# Altium schematic sheet MCU.SchDoc
size A
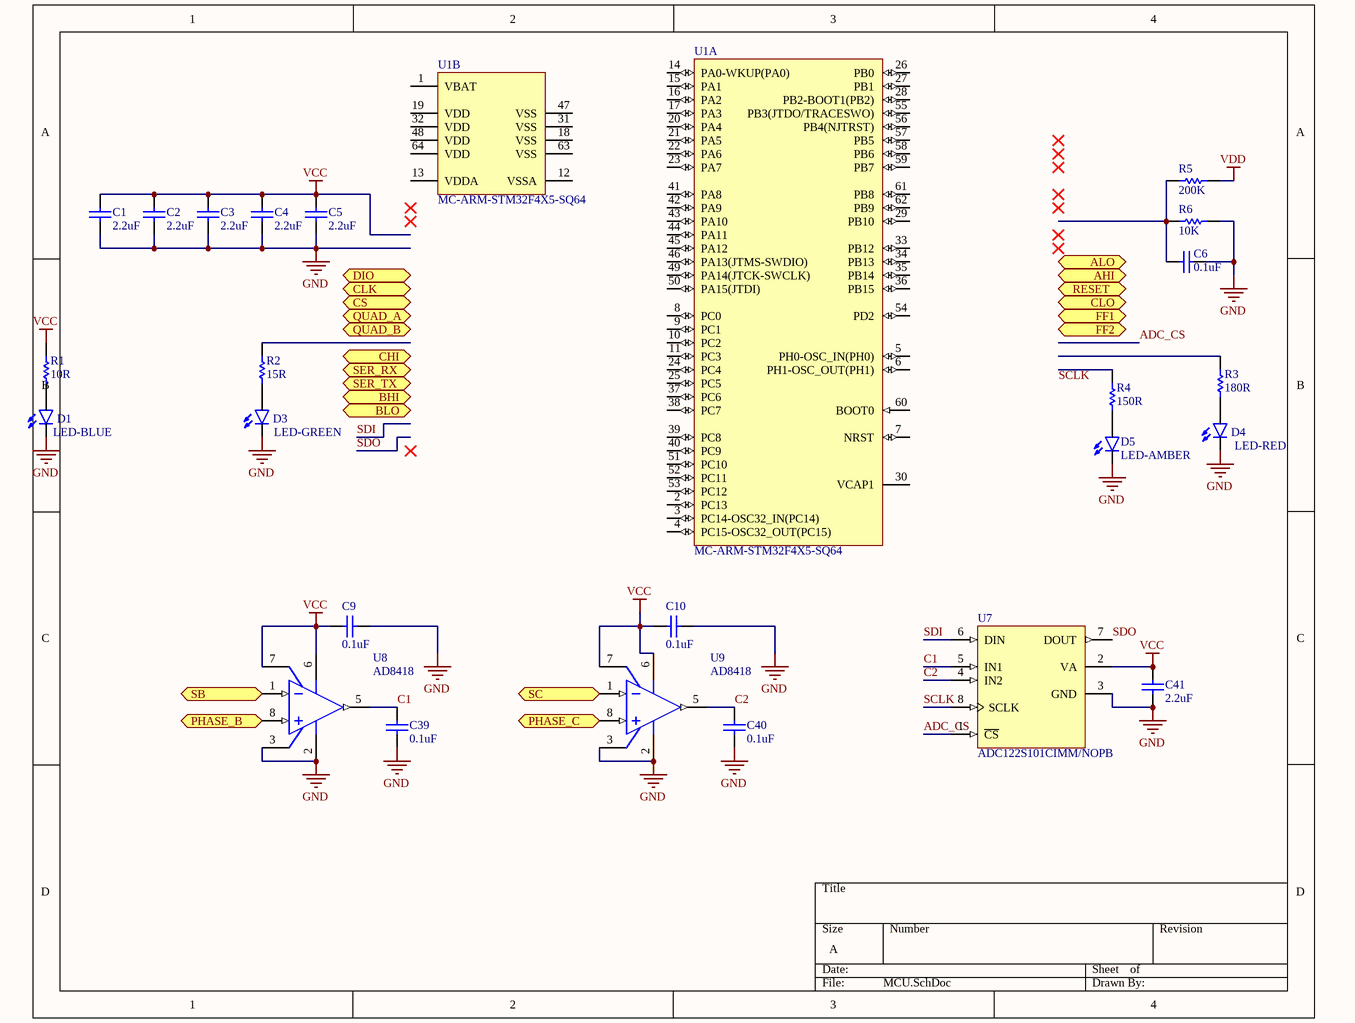
[diagram p0: MCU.SchDoc]

## Parts
C1  2.2uF  [CAPC0603(1608)55_N]
C2  2.2uF  [CAPC0603(1608)55_N]
C3  2.2uF  [CAPC0603(1608)55_N]
C4  2.2uF  [CAPC0603(1608)55_N]
C5  2.2uF  [CAPC0603(1608)55_N]
C6  0.1uF  [CAPC0603(1608)100_L]
C9  0.1uF  [CAPC0603(1608)100_L]
C10  0.1uF  [CAPC0603(1608)100_L]
C39  0.1uF  [CAPC0603(1608)100_M]
C40  0.1uF  [CAPC0603(1608)100_M]
C41  2.2uF  [CAPC0603(1608)100_L]
D1  LED-BLUE  [LED-1206]
D3  LED-GREEN  [LED-1206]
D4  LED-RED  [LED-1206]
D5  LED-AMBER  [LED-1206]
R1  10R  [RESC0603(1608)_N]
R2  15R  [RESC0603(1608)_N]
R3  180R  [RESC0603(1608)_N]
R4  150R  [RESC0603(1608)_N]
R5  200K  [RESC0603(1608)_N]
R6  10K  [RESC0603(1608)_N]
U1  MC-ARM-STM32F4X5-SQ64  [STM-LQFP64_N]  (parts A,B of 2)
U7  ADC122S101CIMM/NOPB  [MUA08A_L]
U8  AD8418  [MSOP-8]
U9  AD8418  [MSOP-8]

## Ports
AHI (out), ALO (out), BHI (out), BLO (out), CHI (out), CLK (out), CLO (out), CS (out), DIO (in), FF1 (in), FF2 (in), PHASE_B (in), PHASE_C (in), QUAD_A (in), QUAD_B (in), RESET (out), SB (in), SC (in), SER_RX (in), SER_TX (in)

## Nets
GND: C1.1 C2.1 C3.1 C4.1 C5.1 C6.2 C9.1 C10.1 C39.1 C40.1 C41.1 D1.C D3.C D4.C D5.C R6.2 U7.3(GND) U8.2(GND) U8.3(VREF2) U9.2(GND) U9.3(VREF2)
VCC: C1.2 C2.2 C3.2 C4.2 C5.2 C9.2 C10.2 C41.2 R1.2 U7.2(VA) U8.6(VS) U8.7(VREF1) U9.6(VS) U9.7(VREF1)
VDD: R5.2
ADC_CS: U7.1(~{CS})
C1: C39.2 U7.5(IN1) U8.5(OUT)
C2: C40.2 U7.4(IN2) U9.5(OUT)
PHASE_B: U8.8(IN+) ; port PHASE_B
PHASE_C: U9.8(IN+) ; port PHASE_C
SB: U8.1(IN-) ; port SB
SC: U9.1(IN-) ; port SC
SCLK: U7.8(SCLK)
SDI: U7.6(DIN)
SDO: U7.7(DOUT)
NetC6_1: C6.1 R5.1 R6.1
NetD1_A: D1.A R1.1
NetD3_A: D3.A R2.1
NetD4_A: D4.A R3.1
NetD5_A: D5.A R4.1

Not connected (* = marked no-connect by the designer): R2 2; R3 2; R4 2; U1 1(VBAT) 2(PC13) 3(PC14-OSC32_IN(PC14)) 4(PC15-OSC32_OUT(PC15)) 5(PH0-OSC_IN(PH0)) 6(PH1-OSC_OUT(PH1)) 7(NRST) 8(PC0) 9(PC1) 10(PC2) 11(PC3) 12(VSSA) 13(VDDA) 14(PA0-WKUP(PA0)) 15(PA1) 16(PA2) 17(PA3) 18(VSS) 19(VDD) 20(PA4) 21(PA5) 22(PA6) 23(PA7) 24(PC4) 25(PC5) 26(PB0) 27(PB1) 28(PB2-BOOT1(PB2)) 29(PB10) 30(VCAP1) 31(VSS) 32(VDD) 33(PB12) 34(PB13) 35(PB14) 36(PB15) 37(PC6) 38(PC7) 39(PC8) 40(PC9) 41(PA8) 42(PA9) 43(PA10) 44(PA11) 45(PA12) 46(PA13(JTMS-SWDIO)) 47(VSS) 48(VDD) 49(PA14(JTCK-SWCLK)) 50(PA15(JTDI)) 51(PC10) 52(PC11) 53(PC12) 54(PD2) 55(PB3(JTDO/TRACESWO)) 56(PB4(NJTRST)) 57(PB5) 58(PB6) 59(PB7) 60(BOOT0) 61(PB8) 62(PB9) 63(VSS) 64(VDD)

## Notes on the sheet
- Labels drawn without touching a wire or pin: SCLK

## Library data of the parts
C1-C5 = CMP-1035-02762-1: CAP 2.2uF 16V Â±10% 0603 (1608 Metric) Thickness 0.55mm SMD; Case-EIA: 0603; Case-Metric: 1608; Max Thickness: 0.55 mm; Technology: SMT; Value: 2.2uF; Rated Voltage: 16 V; Tolerance: Â±10%
C6 = CMP-1035-02591-1: CAP 100nF 50V Â±5% 0603 (1608 Metric) Thickness 1mm SMD; Case-Metric: 1608; Case-EIA: 0603; Rated Voltage: 50 V; Max Thickness: 1 mm; Tolerance: Â±5%; Technology: SMT; Value: 100nF
C9 C10 = CMP-1035-02577-1: CAP 100nF 6.3V Â±20% 0603 (1608 Metric) Thickness 1mm SMD; Case-EIA: 0603; Case-Metric: 1608; Technology: SMT; Rated Voltage: 6.3 V; Value: 100nF; Max Thickness: 1 mm; Tolerance: Â±20%
C39 C40 = CMP-1035-02575-1: CAP 100nF 6.3V ±5% 0603 (1608 Metric) Thickness 1mm SMD; Tolerance: Â±5%; Case-Metric: 1608; Case-EIA: 0603; Technology: SMT; Rated Voltage: 6.3 V; Max Thickness: 1 mm; Value: 100nF
C41 = CMP-1035-02754-1: CAP 2.2uF 6.3V ±10% 0603 (1608 Metric) Thickness 1mm SMD; Case-EIA: 0603; Tolerance: Â±10%; Case-Metric: 1608; Technology: SMT; Value: 2.2uF; Rated Voltage: 6.3 V; Max Thickness: 1 mm
D1 = LED-BLUE1206: PROD_ID: DIO-09911
D3 = LED-GREEN1206: PROD_ID: DIO-00862
D4 = LED-RED1206: PROD_ID: DIO-09912
D5 = LED-AMBER1206
R1 = CMP-1012-00026-1: 10R 0.1W 5% 0603 (1608 Metric)  SMD; Case-Metric: 1608; Case-EIA: 0603; Value: 10.00 Ohm; Technology: SMT; Tolerance: 5 %; Power: 0.1 W
R2 = CMP-1012-00030-1: 15R 0.1W 5% 0603 (1608 Metric)  SMD; Case-EIA: 0603; Case-Metric: 1608; Value: 15.00 Ohm; Tolerance: 5 %; Technology: SMT; Power: 0.1 W
R3 = CMP-1012-00056-1: 180R 0.1W 5% 0603 (1608 Metric)  SMD; Value: 180.00 Ohm; Case-EIA: 0603; Case-Metric: 1608; Power: 0.1 W; Technology: SMT; Tolerance: 5 %
R4 = CMP-1012-00054-1: 150R 0.1W 5% 0603 (1608 Metric)  SMD; Case-EIA: 0603; Value: 150.00 Ohm; Case-Metric: 1608; Power: 0.1 W; Tolerance: 5 %; Technology: SMT
R5 = CMP-1012-00129-1: 200K 0.1W 5% 0603 (1608 Metric)  SMD; Case-EIA: 0603; Value: 200000.00 Ohm; Case-Metric: 1608; Technology: SMT; Power: 0.1 W; Tolerance: 5 %
R6 = CMP-1012-00098-1: 10K 0.1W 5% 0603 (1608 Metric)  SMD; Case-EIA: 0603; Value: 10000.00 Ohm; Case-Metric: 1608; Technology: SMT; Tolerance: 5 %; Power: 0.1 W
U7 = CMP-0054-00398-2: 2 Channel, 500 kSPS to 1 MSPS 12-Bit A/D Converter, 8-pin Mini SOIC, Pb-Free; Manufacturer: National Semiconductor; CompType: ADC IC; PackageTopMarking: ZXTT*X24C; PowerWise: Y; ComponentLink1URL: http://www.national.com/ds/AD/ADC122S101.pdf; RoHS: Y; Code_JEDEC: MO-187-AA; RevisionNote: Component URLs added; PinCount: 8; PackageVersion: revF, Apr-2008; ComponentLink2URL: http://www.national.com/pf/AD/ADC122S101.html; ComponentLink3Description: MUA08A Package Page; ComponentLink3URL: http://www.national.com/packaging/folders/mua08a.html; PackageReference: MUA08A; PackageDescription: MINI SOIC, .118 x .118 x .034in, 8 Lead, .0256in Pitch; ComponentLink1Description: ADC122S101 Datasheet; ComponentLink2Description: ADC122S101 Web Page; DatasheetVersion: Jan-2010